# EAGLE design ptn78000w (EAGLE 7.4.0)
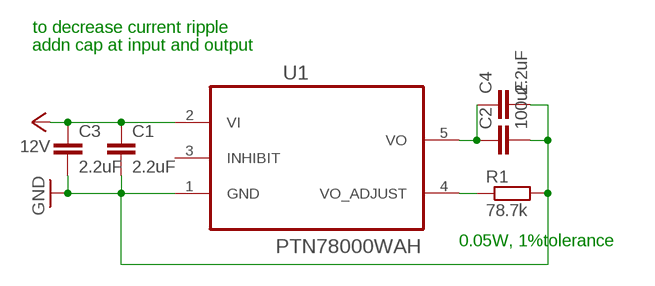
[diagram p0: schematic, sheet 1]

## Parts
C1  2.2uF  C-EUC0805  [C0805]
C2  100uF  C-EUC0805  [C0805]
C3  2.2uF  C-EUC0805  [C0805]
C4  2.2uF  C-EUC0805  [C0805]
R1  78.7k  R-EU_R0805  [R0805]
U1  PTN78000WAH  [TI_PTN78000WAH]

## Nets
GND: C1.2 C2.2 C3.2 C4.2 R1.2 U1.1(GND)
N$1: R1.1 U1.4(VO_ADJUST)
N$4: C2.1 C4.1 U1.5(VO)
VCC: C1.1 C3.1 U1.2(VI) ; supply symbol labelled 12V
Unconnected: U1.3(INHIBIT)

## Notes on the sheet
- to decrease current ripple
- addn cap at input and output
- 0.05W, 1%tolerance

## Library data of the parts
C1-C4 = rcl:C-EU: CAPACITOR, European symbol
R1 = rcl:R-EU_: RESISTOR, European symbol
U1 = PTN78000WAH:PTN78000WAH: SWITCHING REG, 2.5 TO 12.6V 1.5A,Through-Hole Module; MPN: PTN78000WAH; OC_FARNELL: 1564908; OC_NEWARK: 65J6317; PACKAGE: Through-Hole Module; SUPPLIER: TEXAS INSTRUMENTS

## Board
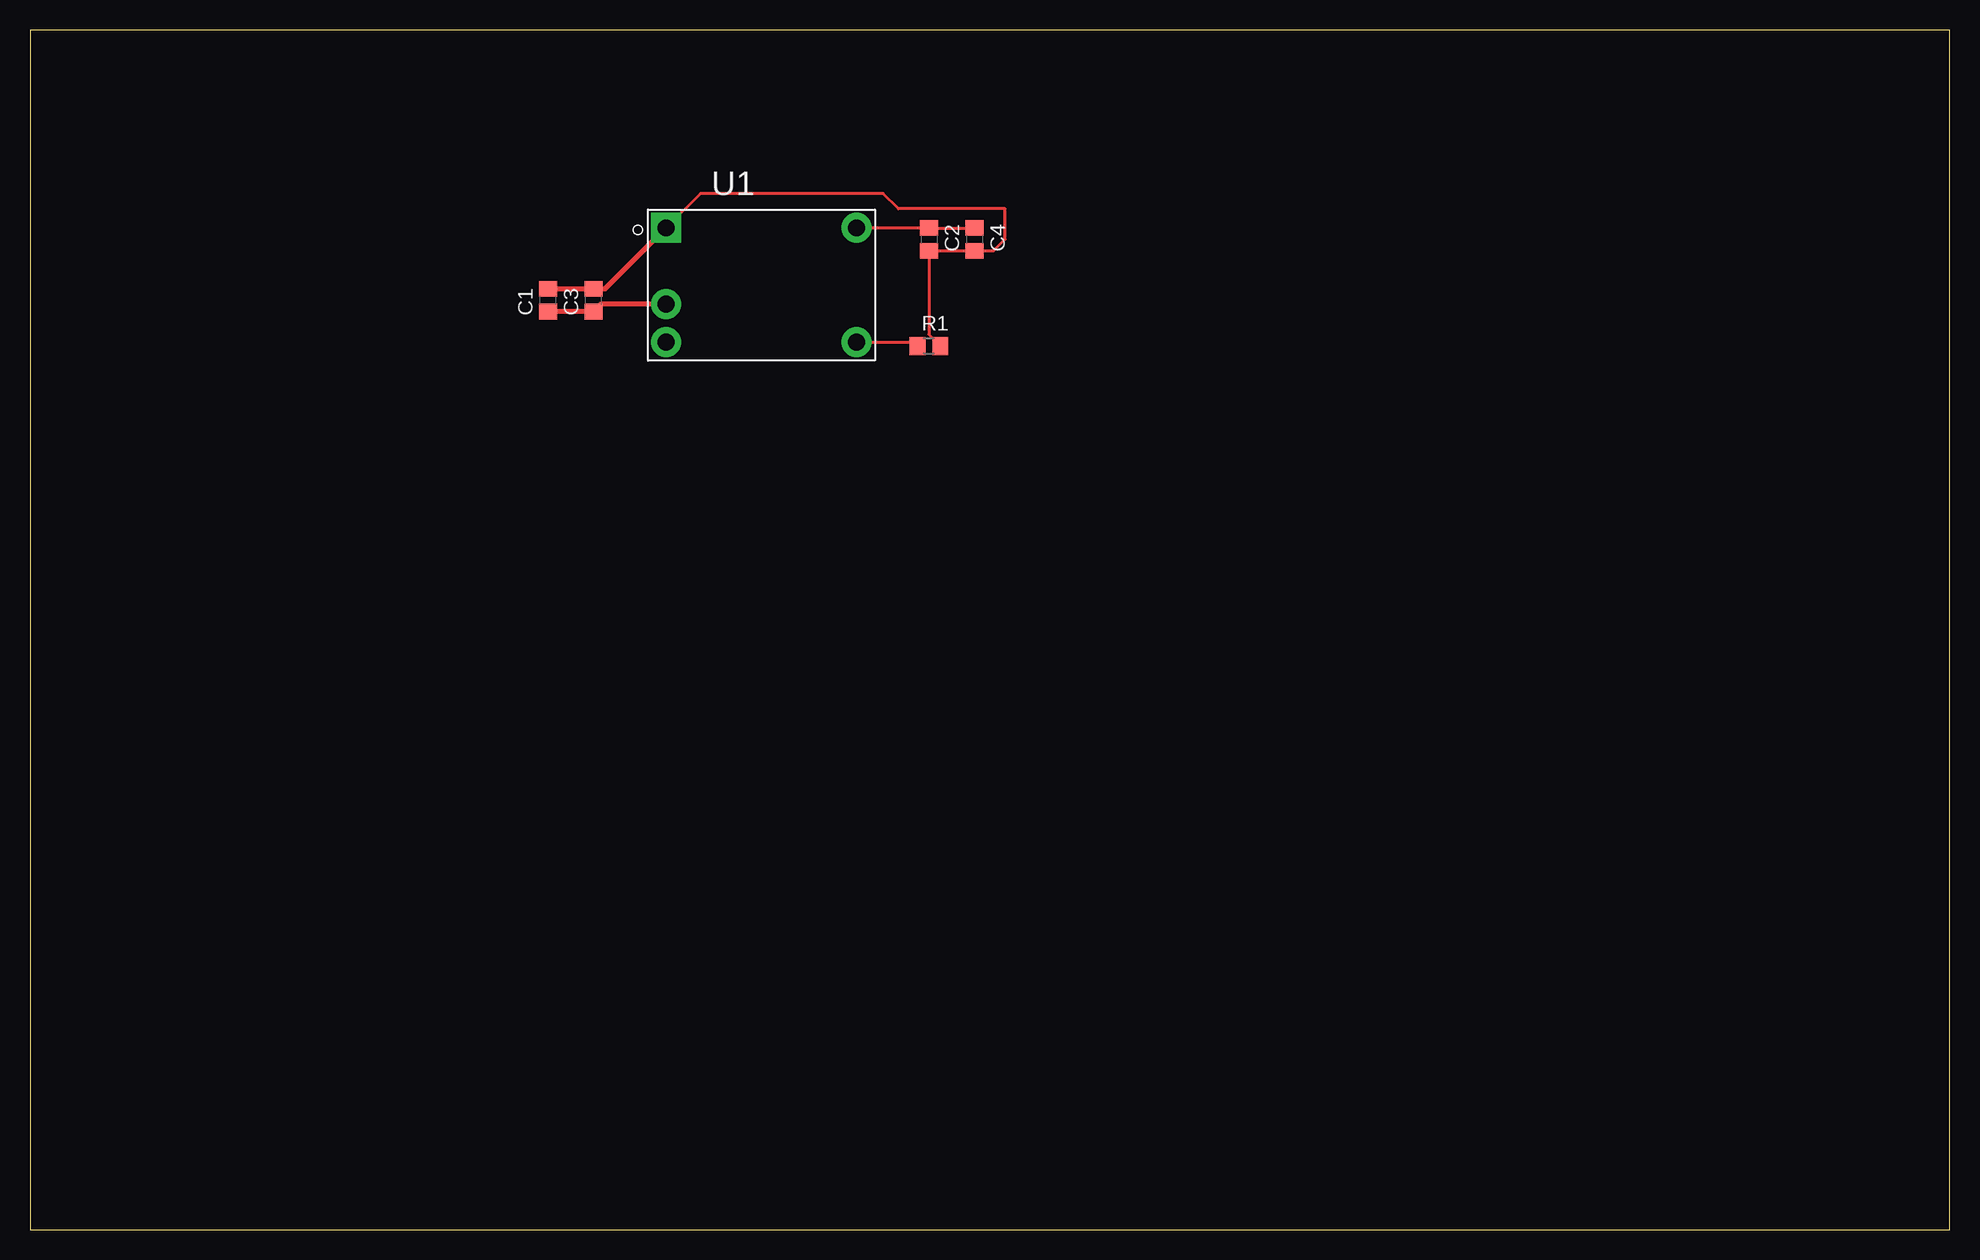
[diagram p1: board, top side]

Size 160 x 100 mm. Coordinates in mm from the lower left corner, seen from the top.
Outline: 0,0 160,0 160,100 0,100 0,0
Copper layers (1*16): Top 0.035mm / dielectric 1.5mm / Bottom 0.035mm
Design rules "default": minimum track width 10mil, minimum drill 24mil, track to track 8mil, track to pad 8mil, pad to pad 8mil, via to via 8mil, smd to smd 8mil, copper to edge 40mil, drill to drill 8mil, minimum pad ring 10mil, minimum via ring 8mil, stop-mask expansion 4mil, vias tented up to drill 0mil, thermal gap 10mil

### Footprints (pad centres in the part's own frame; a part is rotated, then mirrored left to right if it is on the bottom)
C0805 = smd 1.3 x 1.5: 1 -0.95,0; 2 0.95,0
R0805 = smd 1.3 x 1.5: 1 -0.95,0; 2 0.95,0
TI_PTN78000WAH = drill 1.4 pad 2.5 square: 1 -7.94,4.763 | drill 1.4 pad 2.5: 2 -7.94,-1.587; 3 -7.94,-4.763; 4 7.94,-4.763; 5 7.94,4.763

### Placement (x,y rotation side)
C1  43.18,77.47 90 top
C2  74.93,82.55 270 top
C3  46.99,77.47 90 top
C4  78.74,82.55 270 top
R1  74.93,73.66 0 top
U1  60.96,78.74 0 top

### Tracks (layer width: path | path; a pad name or v marks a point on that pad's centre or on a via)
GND
  Top 0.254: C2.2 C4.2 | C2.2 74.93,74.61 R1.2 | C2.2 80.33,81.6 81.28,82.55 81.28,85.09 72.39,85.09 71.12,86.36 55.88,86.36 U1.1
  Top 0.406: C1.2 C3.2 47.94,78.42 U1.1
N$1
  Top 0.254: U1.4 73.66,73.98 R1.1
N$4
  Top 0.254: U1.5 C2.1 C4.1
VCC
  Top 0.406: U1.2 47.62,77.15 C3.1 C1.1